# EasyEDA schematic ESP32S2-new sensor device template.json
TITLE: ESP32 S2 based sensor device; REV: 1.0; Date: 2022-07-05; Sheet: 1/1; Drawn By: Zygfryd Homonto; Company: Your Company
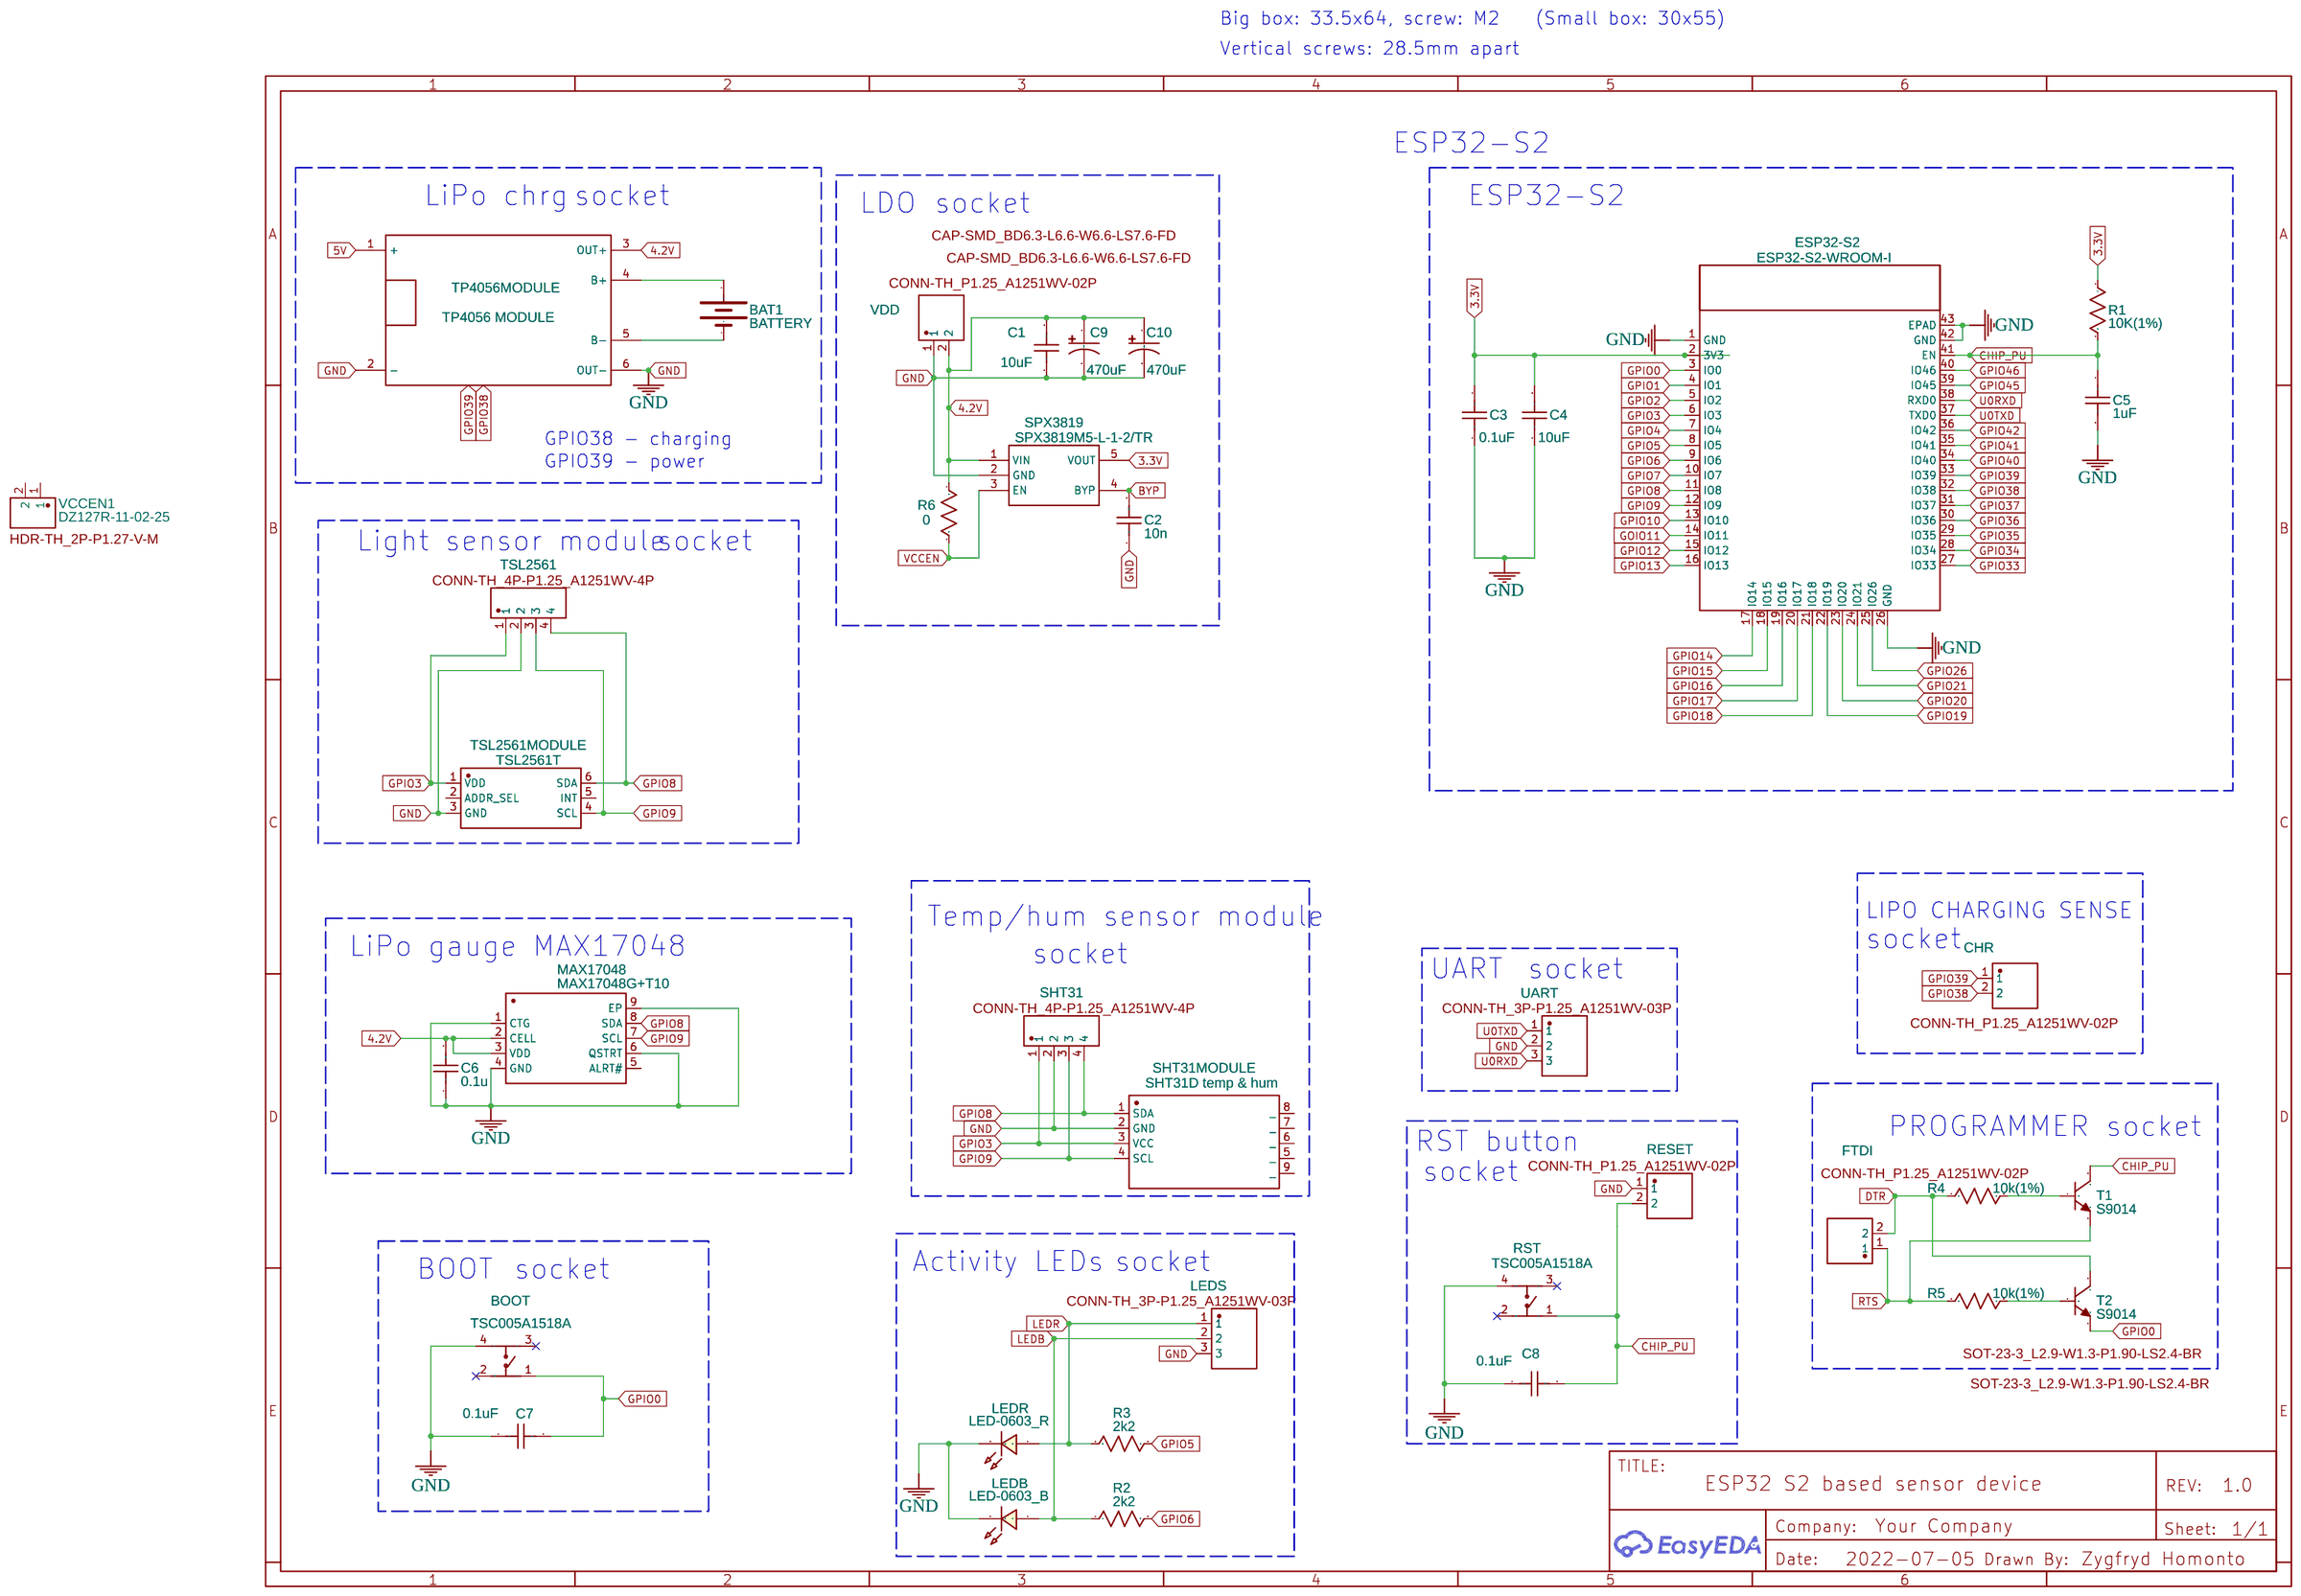
[diagram p0: schematic sheet]

## Parts
BAT1  BATTERY  [LIPO-110-TABS]
BOOT  TSC005A1518A  [SW-SMD_4P-L5.2-W5.2-P3.70-LS6.4]
C1  10uF  [C0603]
C2  10n  [C0603]
C3  0.1uF  [C0603]
C4  10uF  [C0603]
C5  1uF  [C0603]
C6  0.1u  [C0603]
C7  0.1uF  [C0603]
C8  0.1uF  [C0603]
C9  470uF  [CAP-SMD_BD6.3-L6.6-W6.6-LS7.6-FD]
C10  470uF  [CAP-SMD_BD6.3-L6.6-W6.6-LS7.6-FD]
CHR  A1251WR-2P  [CONN-TH_P1.25_A1251WV-02P]
ESP32-S2  ESP32-S2-WROOM-I  [ESP32-S2-WROOM]
FTDI  A1251WR-2P  [CONN-TH_P1.25_A1251WV-02P]
LEDB  LED-0603_B  [LED0603_BLUE]
LEDR  LED-0603_R  [LED0603_RED]
LEDS  A1251WR-3P  [CONN-TH_3P-P1.25_A1251WV-03P]
MAX17048  MAX17048G+T10  [DFN-8_L2.0-W2.0-P0.50-BL-EP]
R1  10K(1%)  [C0603]
R2  2k2  [C0603]
R3  2k2  [C0603]
R4  10k(1%)  [C0603]
R5  10k(1%)  [C0603]
R6  0  [C0603]
RESET  A1251WR-2P  [CONN-TH_P1.25_A1251WV-02P]
RST  TSC005A1518A  [SW-SMD_4P-L5.2-W5.2-P3.70-LS6.4]
SHT31  A1251WR-04P  [CONN-TH_4P-P1.25_A1251WV-4P]
SHT31MODULE  SHT31D temp & hum  [DFN-8_L2.5-W2.5-P0.50-BL-EP]
SPX3819  SPX3819M5-L-1-2/TR  [SOT-23-5_L3.0-W1.7-P0.95-LS2.8-TL]
T1  S9014  [SOT-23-3_L2.9-W1.3-P1.90-LS2.4-BR]
T2  S9014  [SOT-23-3_L2.9-W1.3-P1.90-LS2.4-BR]
TP4056MODULE  TP4056 MODULE  [TP4056 MODULE LITHIUM BATTERY CHARGING MODULE]
TSL2561  A1251WR-04P  [CONN-TH_4P-P1.25_A1251WV-4P]
TSL2561MODULE  TSL2561T  [TMP-6_L3.8-W1.6-P0.90-BL]
UART  A1251WR-3P  [CONN-TH_3P-P1.25_A1251WV-03P]
VCCEN1  DZ127R-11-02-25  [HDR-TH_2P-P1.27-V-M]
VDD  A1251WR-2P  [CONN-TH_P1.25_A1251WV-02P]

## Library data of the parts
BAT1 = BATTERY: Contributor: SparkFun
BOOT RST = TSC005A1518A: Supplier: LCSC; Supplier Part: C2888479; Manufacturer: BZCN(博众电气); Contributor: LCSC; Package Display: No
C1 C3-C5 C7 C8 = C_0201_US: Contributor: LCEDA_Lib
C2 = C_0603_US: Contributor: LCEDA_Lib; Package Display: No
C6 = C_0603_US: Contributor: LCEDA_Lib
C9 C10 = BXJ-16V220-6.3*7.7: Supplier: LCSC; Supplier Part: C165635; Manufacturer: SamYoung Electronics; Contributor: LCSC; JLCPCB Part Class: Extended Part; Package Display: Yes
CHR FTDI RESET VDD = A1251WR-2P: Supplier: LCSC; Supplier Part: C225097; Manufacturer: Changjiang Connectors; Contributor: LCSC; JLCPCB Part Class: Extended Part; Package Display: Yes
ESP32-S2 = ESP32-S2-WROOM: Manufacturer: Espressif Systems; link: https://www.mouser.com/ProductDetail/Espressif-Systems/ESP32-S2-WROVER?qs=sGAEpiMZZMu3sxpa5v1qrtBZTdlU4H0ZBUr%252Bcb7m5M4%3D; Contributor: fabiano.riccardi
LEDB = LED-0603_B: Manufacturer: EVERLIGHT(台湾亿光); Manufacturer Part: 19-217/BHC-ZL1M2RY/3T; Supplier Part: C72041; Supplier: LCSC; Contributor: LCEDA_01; Package Display: No
LEDR = LED-0603_R: Manufacturer: EVERLIGHT(台湾亿光); Manufacturer Part: 19-217/R6C-AL1M2VY/3T; Supplier Part: C72044; Supplier: LCSC; Contributor: LCEDA_01; Package Display: No
LEDS UART = A1251WR-3P: Supplier: LCSC; Supplier Part: C225098; Manufacturer: Changjiang Connectors; Contributor: LCSC; JLCPCB Part Class: Extended Part; Package Display: Yes
MAX17048 = MAX17048G+T10: Supplier: LCSC; Supplier Part: C2682616; Manufacturer: MAXIM(美信); JLCPCB Part Class: Extended Part; Contributor: LCSC
R1-R6 = R_0201_US: Contributor: LCEDA_Lib
SHT31 TSL2561 = A1251WR-04P: Supplier: LCSC; Supplier Part: C462094; Manufacturer: HR(Joint Tech Elec); Contributor: LCSC; JLCPCB Part Class: Extended Part; Package Display: Yes
SHT31MODULE = SHT31-DIS-B: Supplier: LCSC; Manufacturer: Sensirion; Supplier Part: C80862; JLCPCB Part Class: Extended Part
SPX3819 = SPX3819M5-L-1-2/TR: Supplier: LCSC; Manufacturer: EXAR; Supplier Part: C54988; JLCPCB Part Class: Extended Part; Package Display: No
T1 T2 = S9014LT1 (S9014 J6): Supplier: LCSC; Manufacturer: CJ; Supplier Part: C2148; JLCPCB Part Class: Extended Part; Package Display: Yes
TP4056MODULE = TP4056 MODULE: Contributor: jhon78
TSL2561MODULE = TSL2561T: Supplier: LCSC; Supplier Part: C481878; Manufacturer: Advanced Monolithic Systems; Contributor: LCSC; JLCPCB Part Class: Extended Part
VCCEN1 = DZ127R-11-02-25: Supplier: LCSC; Supplier Part: C2935942; Manufacturer: DEALON(德艺隆); Contributor: LCSC; JLCPCB Part Class: Extended Part; Package Display: Yes

## Nets
3.3V: C3.2 C4.2 ESP32-S2.2(3V3) R1.1 SPX3819.5(VOUT)
4.2V: C1.2 C6.2 C9.1 C10.1 MAX17048.2(CELL) MAX17048.3(VDD) R6.1 SPX3819.1(VIN) TP4056MODULE.3(OUT+) VDD.2
5V: TP4056MODULE.1(+)
GND: BOOT.4 C1.1 C2.1 C3.1 C4.1 C5.2 C6.1 C7.1 C8.1 C9.2 C10.2 ESP32-S2.1(GND) ESP32-S2.26(GND) ESP32-S2.42(GND) ESP32-S2.43(EPAD) LEDB.2 LEDR.2 LEDS.3 MAX17048.1(CTG) MAX17048.4(GND) MAX17048.6(QSTRT) MAX17048.9(EP) RESET.1 RST.4 SHT31.2 SHT31MODULE.2(GND) SPX3819.2(GND) TP4056MODULE.2(-) TP4056MODULE.6(OUT-) TSL2561.2 TSL2561MODULE.3(GND) UART.2 VDD.1
VCCEN: R6.2 SPX3819.3(EN)
BYP: C2.2 SPX3819.4(BYP)
CHIP_PU: C5.1 C8.2 ESP32-S2.41(EN) R1.2 RESET.2 RST.1 T1.3(C)
DTR: FTDI.2 R4.1 T2.3(C)
GOIO11: ESP32-S2.14(IO11)
GPIO0: BOOT.1 C7.2 ESP32-S2.3(IO0) T2.2(E)
GPIO1: ESP32-S2.4(IO1)
GPIO2: ESP32-S2.5(IO2)
GPIO3: ESP32-S2.6(IO3) SHT31.1 SHT31MODULE.3(VCC) TSL2561.1 TSL2561MODULE.1(VDD)
GPIO4: ESP32-S2.7(IO4)
GPIO5: ESP32-S2.8(IO5) R3.2
GPIO6: ESP32-S2.9(IO6) R2.2
GPIO7: ESP32-S2.10(IO7)
GPIO8: ESP32-S2.11(IO8) MAX17048.8(SDA) SHT31.4 SHT31MODULE.1(SDA) TSL2561.4 TSL2561MODULE.6(SDA)
GPIO9: ESP32-S2.12(IO9) MAX17048.7(SCL) SHT31.3 SHT31MODULE.4(SCL) TSL2561.3 TSL2561MODULE.4(SCL)
GPIO10: ESP32-S2.13(IO10)
GPIO12: ESP32-S2.15(IO12)
GPIO13: ESP32-S2.16(IO13)
GPIO14: ESP32-S2.17(IO14)
GPIO15: ESP32-S2.18(IO15)
GPIO16: ESP32-S2.19(IO16)
GPIO17: ESP32-S2.20(IO17)
GPIO18: ESP32-S2.21(IO18)
GPIO19: ESP32-S2.22(IO19)
GPIO20: ESP32-S2.23(IO20)
GPIO21: ESP32-S2.24(IO21)
GPIO26: ESP32-S2.25(IO26)
GPIO33: ESP32-S2.27(IO33)
GPIO34: ESP32-S2.28(IO34)
GPIO35: ESP32-S2.29(IO35)
GPIO36: ESP32-S2.30(IO36)
GPIO37: ESP32-S2.31(IO37)
GPIO38: CHR.2 ESP32-S2.32(IO38)
GPIO39: CHR.1 ESP32-S2.33(IO39)
GPIO40: ESP32-S2.34(IO40)
GPIO41: ESP32-S2.35(IO41)
GPIO42: ESP32-S2.36(IO42)
GPIO45: ESP32-S2.39(IO45)
GPIO46: ESP32-S2.40(IO46)
LEDB: LEDB.1 LEDS.2 R2.1
LEDR: LEDR.1 LEDS.1 R3.1
RTS: FTDI.1 R5.1 T1.2(E)
U0RXD: ESP32-S2.38(RXD0) UART.3
U0TXD: ESP32-S2.37(TXD0) UART.1
Net-(BAT1-+): BAT1.+ TP4056MODULE.4(B+)
Net-(BAT1--): BAT1.- TP4056MODULE.5(B-)
Net-(R4-2): R4.2 T1.1(B)
Net-(R5-2): R5.2 T2.1(B)

Not connected (* = marked no-connect by the designer): BOOT 2* 3*; MAX17048 5(ALRT#); RST 2* 3*; SHT31MODULE 5(_) 6(_) 7(_) 8(_) 9(_); TSL2561MODULE 2(ADDR SEL) 5(INT); VCCEN1 1 2

## Notes on the sheet
- Big box: 33.5x64, screw: M2
- (Small box: 30x55)
- Vertical screws: 28.5mm apart
- ESP32-S2
- LiPo chrg
- socket
- LDO
- socket
- ESP32-S2
- GPIO38 - charging
- GPIO39 - power
- Light sensor module
- socket
- Temp/hum sensor module
- LIPO CHARGING SENSE
- LiPo gauge MAX17048
- socket
- socket
- UART
- socket
- RST button
- PROGRAMMER
- socket
- socket
- Activity LEDs
- socket
- BOOT
- socket
